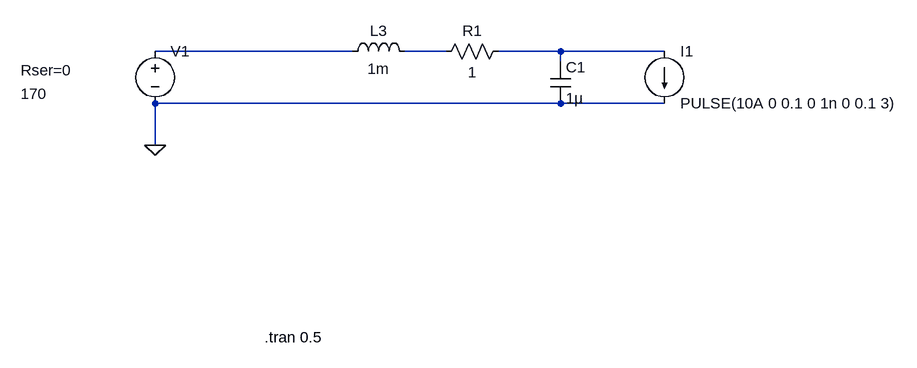
[diagram p0: schematic transformer_resonant_circuit.asc]
transformer_resonant_circuit.asc, the LTspice schematic file:
Version 4
SHEET 1 2164 680
WIRE 80 160 -224 160
WIRE 224 160 160 160
WIRE 400 160 304 160
WIRE 560 160 400 160
WIRE 400 176 400 160
WIRE 400 240 -224 240
WIRE 560 240 400 240
WIRE -224 304 -224 240
FLAG -224 304 0
SYMBOL voltage -224 144 R0
WINDOW 3 -207 81 Left 2
WINDOW 123 24 180 Left 2
WINDOW 39 -207 45 Left 2
SYMATTR Value 170
SYMATTR SpiceLine Rser=0
SYMATTR InstName V1
SYMBOL ind 64 176 R270
WINDOW 0 32 56 VTop 2
WINDOW 3 5 56 VBottom 2
SYMATTR InstName L3
SYMATTR Value 1m
SYMBOL res 320 144 R90
WINDOW 0 0 56 VBottom 2
WINDOW 3 32 56 VTop 2
SYMATTR InstName R1
SYMATTR Value 1
SYMBOL cap 384 176 R0
SYMATTR InstName C1
SYMATTR Value 1µ
SYMBOL current 560 160 R0
WINDOW 123 0 0 Left 0
WINDOW 39 0 0 Left 0
SYMATTR InstName I1
SYMATTR Value PULSE(10A 0 0.1 0 1n 0 0.1 3)
TEXT -56 600 Left 2 !.tran 0.5

The netlist it stands for:
* transformer_resonant_circuit.asc
V1 N001 0 170 Rser=0
L3 N001 N002 1m
R1 N003 N002 1
C1 N003 0 1µ
I1 N003 0 PULSE(10A 0 0.1 0 1n 0 0.1 3)
.tran 0.5
.backanno
.end